# EAGLE design SkyLab V5 (EAGLE 9.0.1)
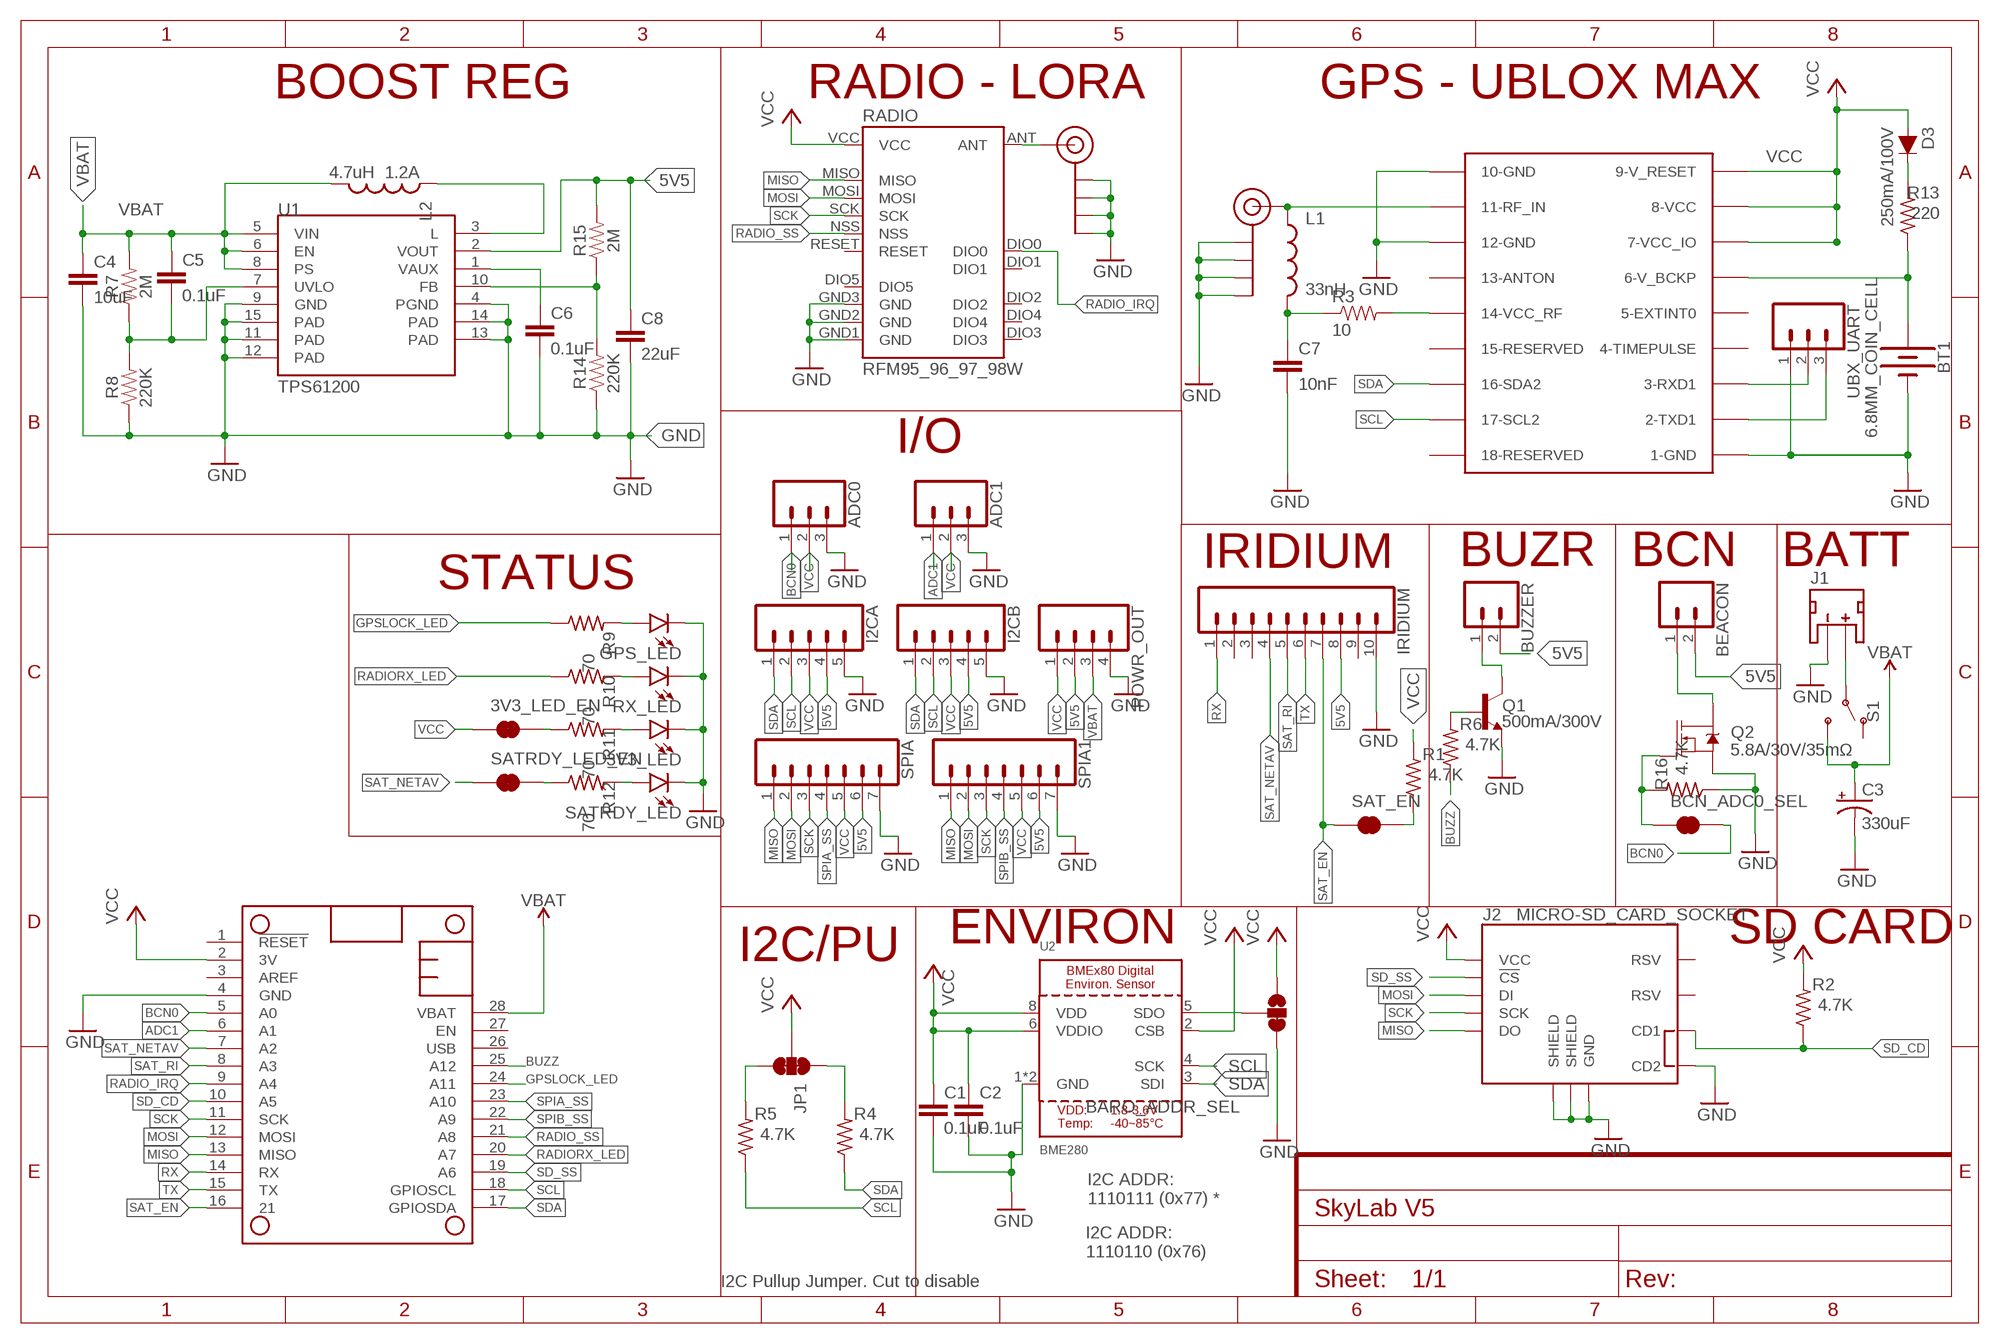
[diagram p0: schematic, sheet 1]
FRAME1 (FRAME-A4L): CNAME: HLM StemLab @ ASFM; CREVISION: 1.0

## Parts
3V3_LED  LED1206  [LED-1206]
3V3_LED_EN  JUMPER-SMT_2_NC_TRACE_SILK  [SMT-JUMPER_2_NC_TRACE_SILK]
ADC0  CONN_03  [1X03]
ADC1  CONN_03  [1X03]
BARO_ADDR_SEL  JUMPER-SMT_3_1-NC_TRACE_SILK  [SMT-JUMPER_3_1-NC_TRACE_SILK]
BCN_ADC0_SEL  JUMPER-SMT_2_NC_TRACE_SILK  [SMT-JUMPER_2_NC_TRACE_SILK]
BEACON  CONN_02  [1X02]
BT1  6.8MM_COIN_CELL  BATTERY-6.8MM_SMD  [BATTCON-6.8MM]
BUZZER  CONN_02  [1X02]
C1  0.1uF  0.1UF-0603-25V-(+80/-20%)  [0603]
C2  0.1uF  0.1UF-0603-25V-(+80/-20%)  [0603]
C3  330uF  CAP_POL6032  [EIA6032]
C4  10uF  10UF-1206-6.3V-20%  [1206]
C5  0.1uF  0.1UF-0603-25V-(+80/-20%)  [0603]
C6  0.1uF  0.1UF-0603-25V-(+80/-20%)  [0603]
C7  10nF  0.1UF-0603-25V-(+80/-20%)  [0603]
C8  22uF  22UF-0805-6.3V-20%  [0805]
D3  250mA/100V  DIODE-BAS16J  [SOD-323]
GPS_ANT  SMA_EDGE  [SMA-EDGE]
GPS_LED  LED1206  [LED-1206]
I2CA  CONN_05  [1X05]
I2CB  CONN_05  [1X05]
IRIDIUM  CONN_10"  [1X10]
J1  JST_2MM_MALE  [JST-2-SMD]
J2  MICRO-SD_CARD_SOCKET  [MICRO-SD-SOCKET]
JP1  JUMPER-SMT_3_2-NC_TRACE_SILK  [SMT-JUMPER_3_2-NC_TRACE_SILK]
L1  33nH  INDUCTOR0603  [0603]
L2  4.7uH 1.2A  INDUCTOR0603  [0603]
MS1  FEATHERWING_NODIM  [FEATHERWING_DIM]
POWR_OUT  CONN_04  [1X04]
Q1  500mA/300V  TRANS_NPN-MMBTA42  [SOT23-3]
Q2  5.8A/30V/35mΩ  MOSFET-NCH-AO3404A  [SOT23-3]
R1  4.7K  R-US_M0805  [M0805]
R2  4.7K  R-US_M0805  [M0805]
R3  10  RESISTOR0603-RES  [0603-RES]
R4  4.7K  R-US_M0805  [M0805]
R5  4.7K  R-US_M0805  [M0805]
R6  4.7K  R-US_M0805  [M0805]
R7  2M  0.22OHM-0805-1/4W-1%  [0805]
R8  220K  0.22OHM-0805-1/4W-1%  [0805]
R9  70  R-US_M0805  [M0805]
R10  70  R-US_M0805  [M0805]
R11  70  R-US_M0805  [M0805]
R12  70  R-US_M0805  [M0805]
R13  220  R-US_M0805  [M0805]
R14  220K  0.22OHM-0805-1/4W-1%  [0805]
R15  2M  0.22OHM-0805-1/4W-1%  [0805]
R16  4.7K  R-US_M0805  [M0805]
RADIO  RFM95_96_97_98W  [RFM95_96_97_98W]
RDIO_ANT  SMA_EDGE  [SMA-EDGE]
RX_LED  LED1206  [LED-1206]
S1  SWITCH-SPDT-SMD-RIGHT-ANGLE  [SWITCH_SPST_SMD_A]
SAT_EN  JUMPER-SMT_2_NC_TRACE_SILK  [SMT-JUMPER_2_NC_TRACE_SILK]
SATRDY_LED  LED1206  [LED-1206]
SATRDY_LED_EN  JUMPER-SMT_2_NC_TRACE_SILK  [SMT-JUMPER_2_NC_TRACE_SILK]
SPIA  CONN_07  [1X07]
SPIA1  CONN_07  [1X07]
U1  TPS61200  [QFN-10_PAD]
U2  BME280  [BME280]
UBLOX  UBLOX_MAX  [UBLOX_MAX]
UBX_UART  CONN_03  [1X03]

## Nets
5V5: BEACON.2 BUZZER.2 C8.1 I2CA.4 I2CB.4 IRIDIUM.8 POWR_OUT.2 R15.2 SPIA1.6 SPIA.6 U1.2(VOUT)
ADC1: ADC1.1 MS1.6(A1)
BCN0: ADC0.1 BCN_ADC0_SEL.2 MS1.5(A0)
BUZZ: MS1.25(A12) R6.1
EDITINF: BCN_ADC0_SEL.1 Q2.1(G) R16.2
GND: 3V3_LED.C ADC0.3 ADC1.3 BARO_ADDR_SEL.3 BT1.- C1.2 C2.2 C3.P$2(-) C4.2 C6.2 C7.2 C8.2 GPS_ANT.GND@0(GND) GPS_ANT.GND@1(GND) GPS_ANT.GND@2(GND) GPS_ANT.GND@3(GND) GPS_LED.C I2CA.5 I2CB.5 IRIDIUM.10 J1.1(-) J2.CD2 J2.GND J2.GND1(SHIELD) J2.GND3(SHIELD) MS1.4(GND) POWR_OUT.4 Q1.2(E) Q2.2(S) R8.1 R14.1 R16.1 RADIO.GND1(GND) RADIO.GND2(GND) RADIO.GND3(GND) RDIO_ANT.GND@0(GND) RDIO_ANT.GND@1(GND) RDIO_ANT.GND@2(GND) RDIO_ANT.GND@3(GND) RX_LED.C SATRDY_LED.C SPIA1.7 SPIA.7 U1.4(PGND) U1.9(GND) U1.11(PAD) U1.12(PAD) U1.13(PAD) U1.14(PAD) U1.15(PAD) U2.1(GND) U2.7(GND) UBLOX.1-GND UBLOX.10-GND UBLOX.12-GND UBX_UART.1
GPSLOCK_LED: MS1.24(A11) R9.1
MISO: J2.DO MS1.13(MISO) RADIO.MISO SPIA1.1 SPIA.1
MOSI: J2.DI MS1.12(MOSI) RADIO.MOSI SPIA1.2 SPIA.2
N$1: R1.1 SAT_EN.2
N$2: GPS_ANT.SIG(SIGNAL) L1.1 UBLOX.11-RFIN(11-RF_IN)
N$3: C7.1 L1.2 R3.1
N$4: R3.2 UBLOX.14-VCC_RF
N$5: RADIO.ANT RDIO_ANT.SIG(SIGNAL)
N$6: JP1.3 R5.2
N$7: JP1.1 R4.2
N$8: Q1.1(B) R6.2
N$9: BUZZER.1 Q1.3(C)
N$10: GPS_LED.A R9.2
N$11: BT1.+ R13.1 UBLOX.6-V_BCKP
N$12: R12.1 SATRDY_LED_EN.2
N$13: R10.2 RX_LED.A
N$14: 3V3_LED.A R11.2
N$15: 3V3_LED_EN.2 R11.1
N$16: D3.C R13.2
N$17: BARO_ADDR_SEL.2 U2.5(SDO)
N$18: R12.2 SATRDY_LED.A
N$19: C5.2 R7.1 R8.2 U1.7(UVLO)
N$20: UBLOX.3-RXD1 UBX_UART.2
N$21: UBLOX.2-TXD1 UBX_UART.3
N$22: R14.2 R15.1 U1.10(FB)
N$23: L2.1 U1.3(L)
N$24: C6.1 U1.1(VAUX)
N$25: BEACON.1 Q2.3(D)
RADIO_IRQ: MS1.9(A4) RADIO.DIO0
RADIO_SS: MS1.21(A8) RADIO.NSS
RADIORX_LED: MS1.20(A7) R10.1
RX: IRIDIUM.1 MS1.14(RX)
SAT_EN: IRIDIUM.7 MS1.16 SAT_EN.1
SAT_NETAV: IRIDIUM.4 MS1.7(A2) SATRDY_LED_EN.1
SAT_RI: IRIDIUM.5 MS1.8(A3)
SCK: J2.SCLK(SCK) MS1.11(SCK) RADIO.SCK SPIA1.3 SPIA.3
SCL: I2CA.2 I2CB.2 MS1.18(GPIOSCL) R5.1 U2.4(SCK) UBLOX.17-SCL2
SD_CD: J2.CD1 MS1.10(A5) R2.1
SD_SS: J2.CS(!CS) MS1.19(A6)
SDA: I2CA.1 I2CB.1 MS1.17(GPIOSDA) R4.1 U2.3(SDI) UBLOX.16-SDA2
SPIA_SS: MS1.23(A10) SPIA.4
SPIB_SS: MS1.22(A9) SPIA1.4
TX: IRIDIUM.6 MS1.15(TX)
VBAT: C3.P$1(+) C4.1 C5.1 L2.2 MS1.28(VBAT) POWR_OUT.3 R7.2 S1.3(S) U1.5(VIN) U1.6(EN) U1.8(PS)
VBAT_SUPPLY: J1.2(+) S1.2(P)
VCC: 3V3_LED_EN.1 ADC0.2 ADC1.2 BARO_ADDR_SEL.1 C1.1 C2.1 D3.A I2CA.3 I2CB.3 J2.VCC JP1.2 MS1.2(3V) POWR_OUT.1 R1.2 R2.2 RADIO.VCC SPIA1.5 SPIA.5 U2.2(CSB) U2.6(VDDIO) U2.8(VDD) UBLOX.7-VCC_IO UBLOX.8-VCC UBLOX.9-V_RESET
Unconnected: IRIDIUM.2 IRIDIUM.3 IRIDIUM.9 J1.NC1(PAD1) J1.NC2(PAD2) J2.RSV1(RSV) J2.RSV2(RSV) MS1.1(!RESET) MS1.3(AREF) MS1.26(USB) MS1.27(EN) RADIO.DIO1 RADIO.DIO2 RADIO.DIO3 RADIO.DIO4 RADIO.DIO5 RADIO.RESET S1.1(O) UBLOX.4-TIMEPULSE UBLOX.5-EXTINT0 UBLOX.13-ANTON UBLOX.15-RESERVED UBLOX.18-RESERVED

## Notes on the sheet
- BOOST REG | RADIO - LORA | GPS - UBLOX MAX
- I/O
- IRIDIUM | BUZR | BCN | BATT
- STATUS
- ENVIRON | SD CARD
- I2C/PU
- I2C ADDR:
  1110111 (0x77) *
- I2C ADDR:
  1110110 (0x76)
- I2C Pullup Jumper. Cut to disable

## Library data of the parts
3V3_LED GPS_LED RX_LED SATRDY_LED = SparkFun-LED:LED: LED (Generic) Standard schematic elements and footprints for 5mm, 3mm, 1206, and 0603 sized LEDs. Generic LEDs with no color specified.
3V3_LED_EN BCN_ADC0_SEL SAT_EN SATRDY_LED_EN = SparkFun-Jumpers:JUMPER-SMT_2_NC_TRACE: Normally closed trace jumper This jumper has a trace between two pads so it's normally closed (NC). Use a razor knife to open the connection. For best results follow the IPC guidelines for cutting traces: Cutout at least 0.063 mm (0.005 in). Remove all loose material to clean up the cut area. Seal the cut with an approved epoxy. Reapply solder to reclose the connection.
ADC0 ADC1 UBX_UART = SparkFun-Connectors:CONN_03: Multi connection point. Often used as Generic Header-pin footprint for 0.1 inch spaced/style header connections On any of the 0.1 inch spaced packages, you can populate with these: Break Away Headers - Straight (PRT-00116) Break Away Male Headers - Right Angle (PRT-00553) Female Headers (PRT-00115) Break Away Headers - Machine Pin (PRT-00117) Break Away Female Headers - Swiss Machine Pin (PRT-00743) Stackable Header - 3 Pin (Female, 0.1") (PRT-13875) For SCREWTERMINALS and SPRING TERMINALS visit here: Screw Terimnals on SparkFun.com (5mm/3.5mm/2.54mm spacing) This device is also useful as a general connection point to wire up your design to another part of your project. Our various solder wires solder well into these plated through hole pads. Hook-Up Wire - Assortment (Stranded, 22 AWG) (PRT-11375) Hook-Up Wire - Assortment (Solid Core, 22 AWG) (PRT-11367) View the entire wire category on our website here Special notes: Molex polarized connector foot print use with SKU : PRT-08232 with associated crimp pins and housings.
BARO_ADDR_SEL = SparkFun-Jumpers:JUMPER-SMT_3_1-NC_TRACE: Normally closed trace jumper (1 of 2 connections) This jumper has a trace between two pads so it's normally closed (NC). The other connection is normally open (NO). Use a razor knife to open the connection. For best results follow the IPC guidelines for cutting traces: Cutout at least 0.063 mm (0.005 in). Remove all loose material to clean up the cut area. Seal the cut with an approved epoxy. Reapply solder to reclose the connection, or to close the NO connection.
BEACON BUZZER = SparkFun-Connectors:CONN_02: Multi connection point. Often used as Generic Header-pin footprint for 0.1 inch spaced/style header connections On any of the 0.1 inch spaced packages, you can populate with these: Break Away Headers - Straight (PRT-00116) Break Away Male Headers - Right Angle (PRT-00553) Female Headers (PRT-00115) Break Away Headers - Machine Pin (PRT-00117) Break Away Female Headers - Swiss Machine Pin (PRT-00743) For SCREWTERMINALS and SPRING TERMINALS visit here: Screw Terimnals on SparkFun.com (5mm/3.5mm/2.54mm spacing) This device is also useful as a general connection point to wire up your design to another part of your project. Our various solder wires solder well into these plated through hole pads. Hook-Up Wire - Assortment (Stranded, 22 AWG) (PRT-11375) Hook-Up Wire - Assortment (Solid Core, 22 AWG) (PRT-11367) View the entire wire category on our website here Special notes: Molex polarized connector foot print use with: PRT-08233 with associated crimp pins and housings. 2.54_SCREWTERM for use with PRT-10571. 3.5mm Screw Terminal footprints for PRT-08084 5mm Screw Terminal footprints for use with PRT-08432
BT1 = SparkFun-Batteries:BATTERY: Battery - Single Cell A variety of battery chemistries, sizes, and footprints. Device List: 20MM_PTH - Coin Cell Battery Holder - 20mm (PTH) 6.8MM_PTH - Coin Cell Battery Holder - 6.8MM(SMD) 12MM_SMD - Coin Cell Battery Holder - 12mm (SMD) 12MM_PTH - Coin Cell Battery Holder - 12mm (PTH) 20MM_SMD - 20mm Coin Cell Battery Holder (SMD) (2 legs) Used on the Big Time Watch Kit 20MM_SMD_4LEGS - Coin Cell Battery Holder - 20mm (SMD) 20MM_SMD_4LEGS_OVERPASTE - Coin Cell Battery Holder - 20mm (SMD) (Over-paste on the legs) 24.5MM_PTH - Coin Cell Battery Holder - 24.5mm (PTH) 9V - 9V Battery Holder - PC Mount Used on the SparkFun SparkPunk Sound Kit and SparkFun SparkPunk Sequencer Kit 18650 - Battery Holder - 18650 (PTH) AA - Battery Holder - 1xAA (PTH) AAA - Battery Holder - 1xAAA (PTH) AA_KIT - Battery Holder - 1xAA (PTH) Special kit package - pads only have exposed copper on one side of the board. AAA_KIT - Battery Holder - 1xAAA (PTH) Special kit package - pads only have exposed copper on one side of the board.; PROD_ID: BATT-13734
C1 C2 C5 C6 = SparkFun-Capacitors:0.1UF: 0.1µF ceramic capacitors A capacitor is a passive two-terminal electrical component used to store electrical energy temporarily in an electric field.; PROD_ID: CAP-00810
C3 = SparkFun-Passives:CAP_POL: Capacitor Polarized These are standard SMD and PTH capacitors. Normally 10uF, 47uF, and 100uF in electrolytic and tantalum varieties. Always verify the external diameter of the through hole cap, it varies with capacity, voltage, and manufacturer. The EIA devices should be standard.
C4 = SparkFun-Capacitors:10UF: 10.0µF ceramic capacitors A capacitor is a passive two-terminal electrical component used to store electrical energy temporarily in an electric field.; PROD_ID: CAP-10057
C7 = SparkFun-Capacitors:0.1UF: 0.1µF ceramic capacitors A capacitor is a passive two-terminal electrical component used to store electrical energy temporarily in an electric field.; PROD_ID: CAP-00810; VALUE: 0.1uF
C8 = SparkFun-Capacitors:22UF: 22µF ceramic capacitors A capacitor is a passive two-terminal electrical component used to store electrical energy temporarily in an electric field.; PROD_ID: CAP-08402
D3 = SparkFun-DiscreteSemi:DIODE: Diode These are standard reverse protection diodes and small signal diodes. SparkFun Products: SparkFun SparkPunk Sound Kit <https://www.sparkfun.com/products/11177> SparkFun ESP8266 Thing <https://www.sparkfun.com/products/13231>; PROD_ID: DIO-09646
GPS_ANT = SparkFun:SMA_EDGE: SMA Antenna Connector End launch SMA connector. The paste layer has been removed so that the connector can be hand soldered onto the board after reflow.
I2CA I2CB = SparkFun-Connectors:CONN_05: Multi connection point. Often used as Generic Header-pin footprint for 0.1 inch spaced/style header connections On any of the 0.1 inch spaced packages, you can populate with these: Break Away Headers - Straight (PRT-00116) Break Away Male Headers - Right Angle (PRT-00553) Female Headers (PRT-00115) Break Away Headers - Machine Pin (PRT-00117) Break Away Female Headers - Swiss Machine Pin (PRT-00743) For SCREWTERMINALS and SPRING TERMINALS visit here: Screw Terimnals on SparkFun.com (5mm/3.5mm/2.54mm spacing) This device is also useful as a general connection point to wire up your design to another part of your project. Our various solder wires solder well into these plated through hole pads. Hook-Up Wire - Assortment (Stranded, 22 AWG) (PRT-11375) Hook-Up Wire - Assortment (Solid Core, 22 AWG) (PRT-11367) View the entire wire category on our website here Special notes: Molex polarized connector foot print use with SKU : PRT-08231 with associated crimp pins and housings. 1MM SMD Version SKU: PRT-10208
IRIDIUM = SparkFun-Connectors:CONN_10: Multi connection point. Often used as Generic Header-pin footprint for 0.1 inch spaced/style header connections On any of the 0.1 inch spaced packages, you can populate with these: Break Away Headers - Straight (PRT-00116) Break Away Male Headers - Right Angle (PRT-00553) Female Headers (PRT-00115) Break Away Headers - Machine Pin (PRT-00117) Break Away Female Headers - Swiss Machine Pin (PRT-00743) Arduino Stackable Header - 10 Pin (PRT-11376) For SCREWTERMINALS and SPRING TERMINALS visit here: Screw Terimnals on SparkFun.com (5mm/3.5mm/2.54mm spacing) This device is also useful as a general connection point to wire up your design to another part of your project. Our various solder wires solder well into these plated through hole pads. Hook-Up Wire - Assortment (Stranded, 22 AWG) (PRT-11375) Hook-Up Wire - Assortment (Solid Core, 22 AWG) (PRT-11367) View the entire wire category on our website here Special notes: Molex polarized connector foot print use with SKU : PRT-08231 with associated crimp pins and housings. 1MM SMD Version SKU: PRT-10208 NOTES ON THE VARIANTS LOCK and LOCK_LONGPADS... This footprint was designed to help hold the alignment of a through-hole component (i.e. 6-pin header) while soldering it into place. You may notice that each hole has been shifted either up or down by 0.005 of an inch from it's more standard position (which is a perfectly straight line). This slight alteration caused the pins (the squares in the middle) to touch the edges of the holes. Because they are alternating, it causes a "brace" to hold the component in place. 0.005 has proven to be the perfect amount of "off-center" position when using our standard breakaway headers. Although looks a little odd when you look at the bare footprint, once you have a header in there, the alteration is very hard to notice. Also,if you push a header all the way into place, it is covered up entirely on the bottom side.; PROD_ID: CONN-11563
J1 = SparkFun-Connectors:JST_2MM_MALE: JST 2MM MALE RA CONNECTOR Two pin, compact surface mount connector. Commonly used as a battery input connection point. We really like the solid locking feeling and high current rating on these small connectors. We use these all the time as battery connectors. Mates to single-cell LiPo batteries. Here is the connector we sell at SparkFun: JST Right Angle Connector - White (PRT-08612) Datasheet It was used on these SparkFun products: SparkFun MOSFET Power Controller (PRT-11214) SparkFun Battery Babysitter - LiPo Battery Manager (PRT-13777) And many, many others that required a lipo battery connection.; PROD_ID: CONN-11443; SF_ID: PRT-08612
J2 = SparkFun-Connectors:MICRO-SD_CARD_SOCKET: microSD Socket for Transflash Push-push type µSD socket. tDoc lines correctly indicate media card edge positions when inserting (unlocked, locked, depressed). NOTE: CD1 and CD2 are connected internally, and the default detect state of the socket is detect pin to ground. SparkFun Products: WAV Trigger <https://www.sparkfun.com/products/13660> CAN-Bus Shield <https://www.sparkfun.com/products/13262> SparkFun Level Shifing microSD Breakout <https://www.sparkfun.com/products/13743>; PROD_ID: CONN-07820; SF_ID: PRT-00127
JP1 = SparkFun-Jumpers:JUMPER-SMT_3_2-NC_TRACE: Normally closed trace jumper (2 of 2 connections) This jumper has a trace between all three pads so they are normally closed (NC). Use a razor knife to open the connection(s). For best results follow the IPC guidelines for cutting traces: Cutout at least 0.063 mm (0.005 in). Remove all loose material to clean up the cut area. Seal the cut with an approved epoxy. Reapply solder to reclose the connection(s).
L1 L2 = SparkFun:INDUCTOR: Inductors Basic Inductor/Choke - 0603 and 1206. Footprints are not proven and vary greatly between part numbers.
MS1 = adafruit:FEATHERWING
POWR_OUT = SparkFun-Connectors:CONN_04: Multi connection point. Often used as Generic Header-pin footprint for 0.1 inch spaced/style header connections On any of the 0.1 inch spaced packages, you can populate with these: Break Away Headers - Straight (PRT-00116) Break Away Male Headers - Right Angle (PRT-00553) Female Headers (PRT-00115) Break Away Headers - Machine Pin (PRT-00117) Break Away Female Headers - Swiss Machine Pin (PRT-00743) For SCREWTERMINALS and SPRING TERMINALS visit here: Screw Terimnals on SparkFun.com (5mm/3.5mm/2.54mm spacing) This device is also useful as a general connection point to wire up your design to another part of your project. Our various solder wires solder well into these plated through hole pads. Hook-Up Wire - Assortment (Stranded, 22 AWG) (PRT-11375) Hook-Up Wire - Assortment (Solid Core, 22 AWG) (PRT-11367) View the entire wire category on our website here Special notes: Molex polarized connector foot print use with SKU : PRT-08231 with associated crimp pins and housings. 1MM SMD Version SKU: PRT-10208; PROD_ID: CONN-09696
Q1 = SparkFun-DiscreteSemi:TRANS_NPN: NPN transistor Current controlled devices typically used to amplify current or used as a switch. BC547 - COM-08928 (TO-92 45V 100mA) (1.Collector 2.Base 3.Emitter) 2N3904 - COM-00521 (TO-92 40V 200mA) (1.Emitter 2.Base 3.Collector) P2N2222A - COM-12852 (TO-92 40V 600mA) (1.Collector 2.Base 3.Emitter); PROD_ID: TRANS-09116
Q2 = SparkFun-DiscreteSemi:MOSFET-NCH: N-channel MOSFETs Voltage controlled devices that allow control of high current outputs. SparkFun Products: SparkFun OpenScale <https://www.sparkfun.com/products/13261> SparkFun Digital Sandbox <https://www.sparkfun.com/products/12651> SparkFun Monster Moto Shield <https://www.sparkfun.com/products/10182> SparkFun MOSFET Power Controller <https://www.sparkfun.com/products/11214>; PROD_ID: TRANS-12988
R1 R2 R4-R6 R9-R13 R16 = resistor:R-US_: RESISTOR, American symbol
R3 = SparkFun:RESISTOR: Resistor Basic schematic elements and footprints for 0603, 1206, and PTH resistors.
R7 R8 R14 R15 = SparkFun-Resistors:0.22OHM: 0.22Ω resistor A resistor is a passive two-terminal electrical component that implements electrical resistance as a circuit element. Resistors act to reduce current flow, and, at the same time, act to lower voltage levels within circuits. - Wikipedia; PROD_ID: RES-09883; VALUE: 0.22
RADIO = Ava:RFM95_96_97_98W
RDIO_ANT = SparkFun-Retired:SMA_EDGE: SMA Antenna Connector End launch SMA connector. The paste layer has been removed so that the connector can be hand soldered onto the board after reflow.
S1 = SparkFun-Switches:SWITCH-SPDT: Single Pole, Double Throw (SPDT) Switch Single-pole, double-throw (SPDT) switch. Variant Overview SMD-AYZ0202 Surface Mount DPDT Switch (COM-00597) Used on e.g. LilyPad Arduino USB - ATmega32U4 Board PTH-11.6X4.0MM SPDT Mini Power Switch (COM-00102) Used on e.g. SparkFun Simon Says - Through-Hole Soldering Kit (KIT-10547) PTH-11.6X4.0MM-KIT KIT version of SPDT Mini Power Switch - Simplifies soldering by removing tStop of switch pins - only one side can be soldered. PTH-11.6X4.0MM-LOCK LOCK version of SPDT Mini Power Switch - Offset pins hold switch in place for easier soldering. SMD-RIGHT-ANGLE Surface Mount Right Angle Switch (COM-10860) Used on e.g. SparkFun ESP8266 Thing; PROD_ID: SWCH-10651; SF_SKU: COM-10860
SPIA SPIA1 = SparkFun-Connectors:CONN_07: Multi connection point. Often used as Generic Header-pin footprint for 0.1 inch spaced/style header connections On any of the 0.1 inch spaced packages, you can populate with these: Break Away Headers - Straight (PRT-00116) Break Away Male Headers - Right Angle (PRT-00553) Female Headers (PRT-00115) Break Away Headers - Machine Pin (PRT-00117) Break Away Female Headers - Swiss Machine Pin (PRT-00743) For SCREWTERMINALS and SPRING TERMINALS visit here: Screw Terimnals on SparkFun.com (5mm/3.5mm/2.54mm spacing) This device is also useful as a general connection point to wire up your design to another part of your project. Our various solder wires solder well into these plated through hole pads. Hook-Up Wire - Assortment (Stranded, 22 AWG) (PRT-11375) Hook-Up Wire - Assortment (Solid Core, 22 AWG) (PRT-11367) View the entire wire category on our website here Special notes: Molex polarized connector foot print use with SKU : PRT-08231 with associated crimp pins and housings. 1MM SMD Version SKU: PRT-10208 NOTES ON THE VARIANTS LOCK and LOCK_LONGPADS... This footprint was designed to help hold the alignment of a through-hole component (i.e. 6-pin header) while soldering it into place. You may notice that each hole has been shifted either up or down by 0.005 of an inch from it's more standard position (which is a perfectly straight line). This slight alteration caused the pins (the squares in the middle) to touch the edges of the holes. Because they are alternating, it causes a "brace" to hold the component in place. 0.005 has proven to be the perfect amount of "off-center" position when using our standard breakaway headers. Although looks a little odd when you look at the bare footprint, once you have a header in there, the alteration is very hard to notice. Also,if you push a header all the way into place, it is covered up entirely on the bottom side.
U1 = SparkFun-IC-Power:TPS61200: DC to DC Booster IC-10035; PROD_ID: IC-10035
U2 = microbuilder:BME280: BME280 - Environmental Sensor (I2C + SPI)
UBLOX = Ava:UBLOX_MAX: UBLOX MAX

## Module E
Ports: 

### Library data of the parts

## Net classes
0 default: width 0.203 mm
1 vcc: width 0.254 mm

## Board
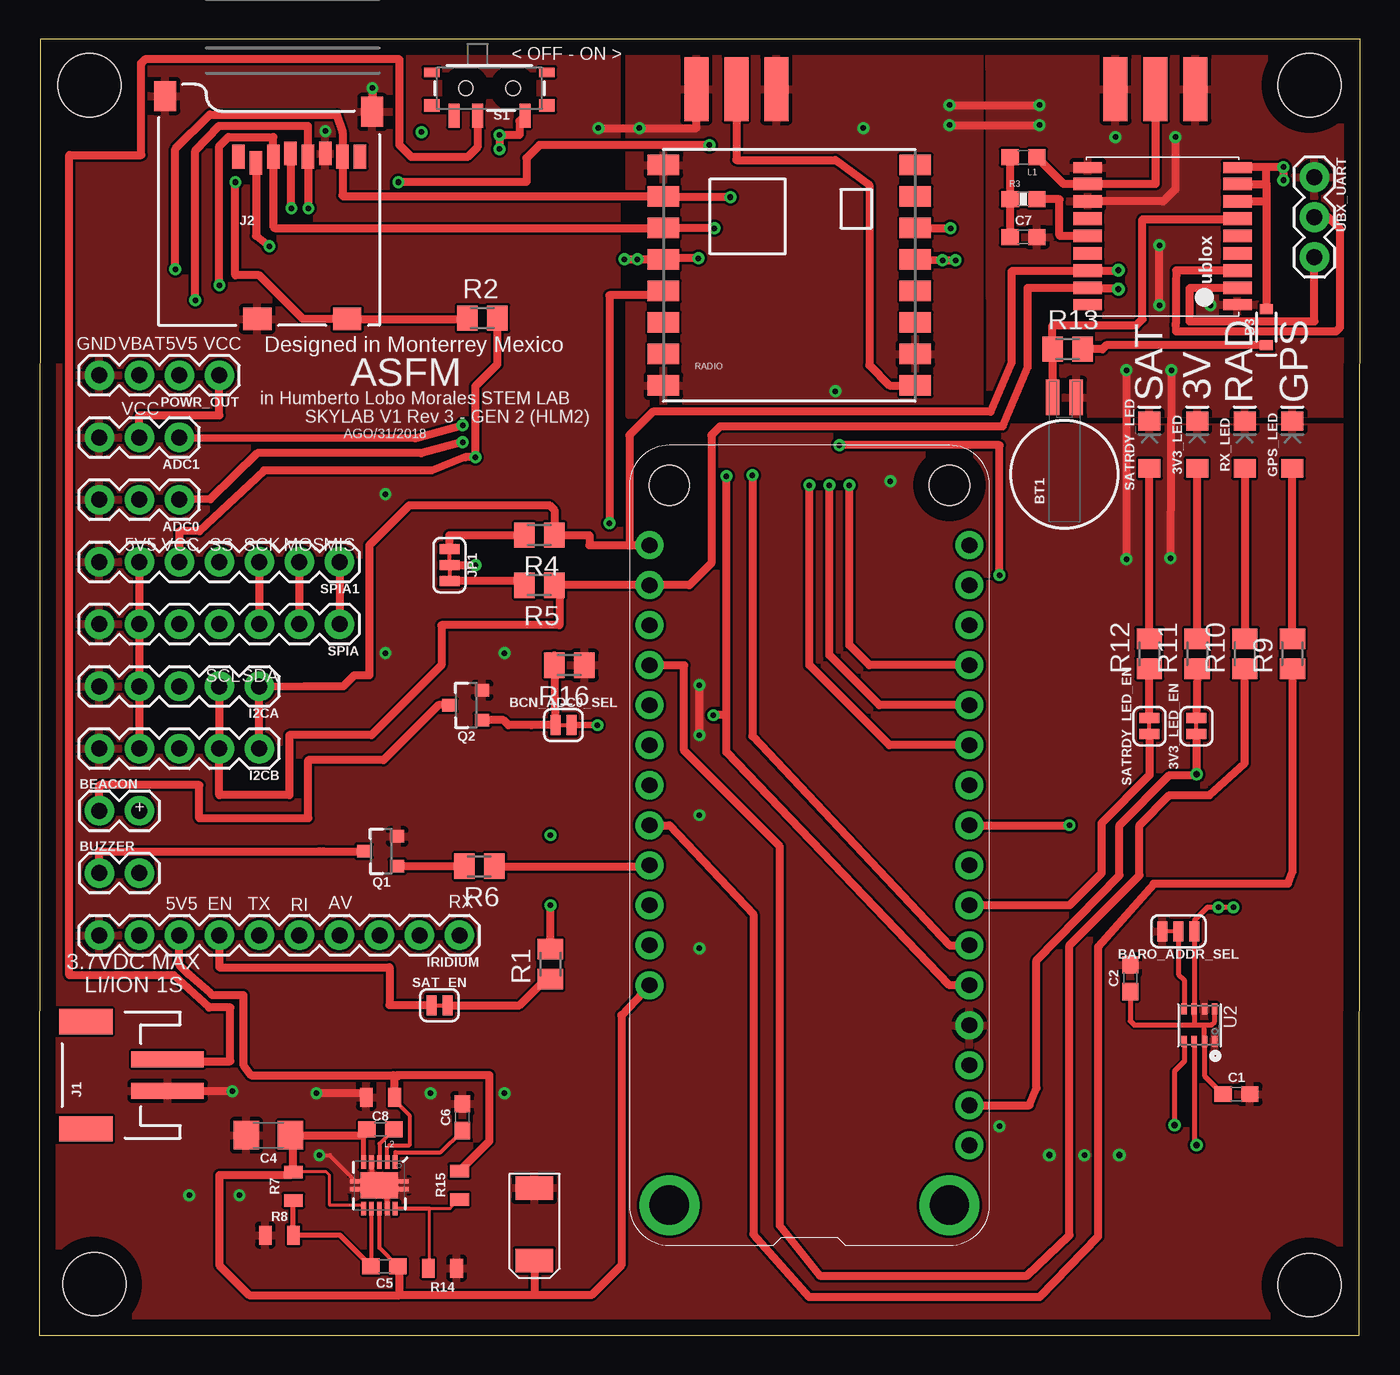
[diagram p1: board, top side]
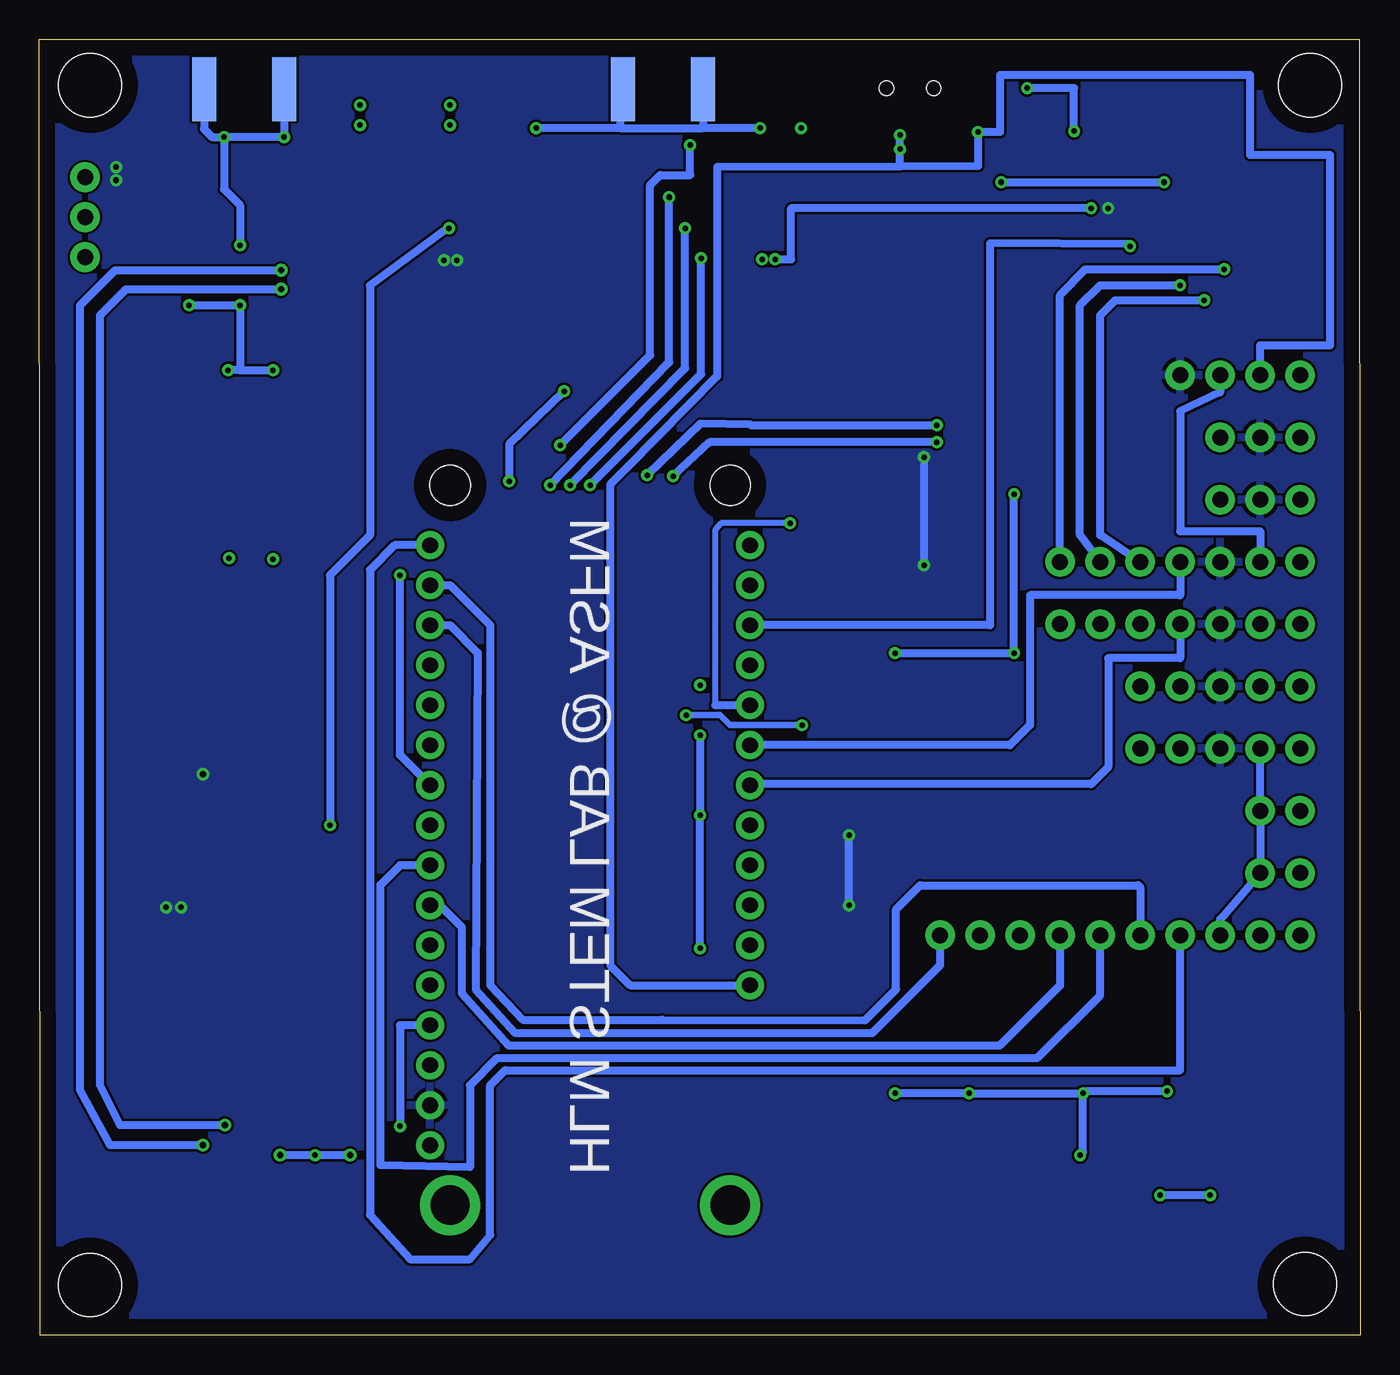
[diagram p2: board, bottom side, seen from below]

Size 83.86 x 82.28 mm. Coordinates in mm from the lower left corner, seen from the top.
Outline: 0,0 83.8,0 83.86,82.28 0.06,82.28 0,0
Copper layers (1*16): Top 0.035mm / dielectric 1.5mm / Bottom 0.035mm
Design rules "default": minimum track width 6mil, minimum drill 0.35mm, track to track 6mil, track to pad 6mil, pad to pad 6mil, via to via 6mil, smd to smd 6mil, copper to edge 40mil, drill to drill 6mil, minimum pad ring 10mil, minimum via ring 8mil, stop-mask expansion 4mil, vias tented up to drill 0mil, thermal gap 10mil
Holes 4 mm at 3.17,79.38 3.49,3.24 80.64,79.38 80.64,3.18

### Footprints (pad centres in the part's own frame; a part is rotated, then mirrored left to right if it is on the bottom)
LED-1206 = smd 1.2 x 1.4: A -1.5,0; C 1.5,0
SMT-JUMPER_2_NC_TRACE_SILK = smd 0.635 x 1.27: 1 -0.508,0; 2 0.508,0
1X03 = drill 1.016 pad 1.88: 1 0,0; 2 2.54,0; 3 5.08,0
SMT-JUMPER_3_1-NC_TRACE_SILK = smd 0.635 x 1.27: 1 -1.016,0; 2 0,0; 3 1.016,0
1X02 = drill 1.016 pad 1.88: 1 0,0; 2 2.54,0
BATTCON-6.8MM = smd 2.25 x 0.85: + 4.87,0.75; - 4.87,-0.75
0603 = smd 1.1 x 1: 1 -0.85,0; 2 0.85,0
EIA6032 = smd 1.5 x 2.4: P$1 -2.3,0; P$2 2.3,0
1206 = smd 1.6 x 1.8: 1 -1.4,0; 2 1.4,0
0805 = smd 0.8 x 1.2: 1 -0.9,0; 2 0.9,0
SOD-323 = smd 0.63 x 0.83: A 1.15,0; C -1.15,0
SMA-EDGE = smd 1.524 x 4.064: GND@0 -2.54,0; GND@1 2.54,0; SIG 0,0 | smd 1.524 x 4.064 bottom: GND@2 -2.54,0; GND@3 2.54,0
1X05 = drill 1.016 pad 1.88: 1 0,0; 2 2.54,0; 3 5.08,0; 4 7.62,0; 5 10.16,0
1X10 = drill 1.016 pad 1.88: 1 0,0; 2 2.54,0; 3 5.08,0; 4 7.62,0; 5 10.16,0; 6 12.7,0; 7 15.24,0; 8 17.78,0; 9 20.32,0; 10 22.86,0
JST-2-SMD = smd 1 x 4.6: 1 -1,-3.7; 2 1,-3.7 | smd 1.6 x 3.4: NC1 -3.4,1.5; NC2 3.4,1.5
MICRO-SD-SOCKET = smd 1.8 x 1.4: CD1 -2.05,0.4; CD2 -7.75,0.4 | smd 0.8 x 1.5: CS -7.84,10.3; DI -6.74,10.7; DO -2.34,10.7; GND -3.44,10.9; RSV1 -8.94,10.7; RSV2 -1.24,10.7; SCLK -4.54,10.7; VCC -5.64,10.9 | smd 1.4 x 1.9: GND1 -13.6,14.55; GND3 -0.45,13.55
SMT-JUMPER_3_2-NC_TRACE_SILK = smd 0.635 x 1.27: 1 -1.016,0; 2 0,0; 3 1.016,0
FEATHERWING_DIM = drill 1 pad 1.778: 1 6.35,1.27; 2 8.89,1.27; 3 11.43,1.27; 4 13.97,1.27; 5 16.51,1.27; 6 19.05,1.27; 7 21.59,1.27; 8 24.13,1.27; 9 26.67,1.27; 10 29.21,1.27; 11 31.75,1.27; 12 34.29,1.27; 13 36.83,1.27; 14 39.37,1.27; 15 41.91,1.27; 16 44.45,1.27; 17 44.45,21.59; 18 41.91,21.59; 19 39.37,21.59; 20 36.83,21.59; 21 34.29,21.59; 22 31.75,21.59; 23 29.21,21.59; 24 26.67,21.59; 25 24.13,21.59; 26 21.59,21.59; 27 19.05,21.59; 28 16.51,21.59 | drill 2.5 pad 3.81: P$1 2.54,20.32; P$2 2.54,2.54 | hole 2.54: 48.26,20.32; 48.26,2.54
1X04 = drill 1.016 pad 1.88: 1 0,0; 2 2.54,0; 3 5.08,0; 4 7.62,0
SOT23-3 = smd 0.8 x 0.9: 1 -0.95,-1; 2 0.95,-1; 3 0,1.1
M0805 = smd 1.3 x 1.6: 1 -0.95,0; 2 0.95,0
0603-RES = smd 1.1 x 1: 1 -0.85,0; 2 0.85,0
RFM95_96_97_98W = smd 2 x 1.3: ANT 8,-7; DIO0 8,3; DIO1 8,5; DIO2 8,7; DIO3 8,-3; DIO4 8,-1; DIO5 -8,-5; GND1 -8,7; GND2 8,-5; GND3 -8,-7; MISO -8,5; MOSI -8,3; NSS -8,-1; RESET -8,-3; SCK -8,1; VCC 8,1
SMA-EDGE' = smd 1.524 x 4.064: GND@0 0,0; GND@1 5.08,0; SIG 2.54,0 | smd 1.524 x 4.064 bottom: GND@2 0,0; GND@3 5.08,0
SWITCH_SPST_SMD_A = smd 0.7 x 1.5: 1 -2.25,-1.75; 2 -0.75,-1.75; 3 2.25,-1.75 | smd 1 x 0.6: GND1 -3.65,1; GND3 3.65,1 | smd 1 x 0.8: GND2 -3.65,-1.1; GND4 3.65,-1.1 | hole 0.9: -1.5,0; 1.5,0
1X07 = drill 1.016 pad 1.88: 1 0,0; 2 2.54,0; 3 5.08,0; 4 7.62,0; 5 10.16,0; 6 12.7,0; 7 15.24,0
QFN-10_PAD = smd 0.297 x 0.85: 1 -1,-1.475; 2 -0.5,-1.475; 3 0,-1.475; 4 0.5,-1.475; 5 1,-1.475; 6 1,1.475; 7 0.5,1.475; 8 0,1.475; 9 -0.5,1.475; 10 -1,1.475 | smd 0.7 x 0.28: 11 -1.5,0.25; 12 -1.5,-0.25; 13 1.5,0.25; 14 1.5,-0.25 | smd 2.4 x 1.65: 15 0,0
BME280 = smd 0.7 x 0.35: 1 1.025,0.975; 2 1.025,0.325; 3 1.025,-0.325; 4 1.025,-0.975; 5 -1.025,-0.975; 6 -1.025,-0.325; 7 -1.025,0.325; 8 -1.025,0.975
UBLOX_MAX = smd 1.8 x 0.7: 1-GND 4.95,-4.4; 9-V_RESET 4.95,4.3; 10-GND -4.55,4.3; 18-RESERVED -4.55,-4.4 | smd 1.8 x 0.8: 2-TXD1 4.95,-3.35; 3-RXD1 4.95,-2.25; 4-TIMEPULSE 4.95,-1.15; 5-EXTINT0 4.95,-0.05; 6-V_BCKP 4.95,1.05; 7-VCC_IO 4.95,2.15; 8-VCC 4.95,3.25; 11-RFIN -4.55,3.25; 12-GND -4.55,2.15; 13-ANTON -4.55,1.05; 14-VCC_RF -4.55,-0.05; 15-RESERVED -4.55,-1.15; 16-SDA2 -4.55,-2.25; 17-SCL2 -4.55,-3.35

### Placement (x,y rotation side)
3V3_LED  73.51,56.55 90 top
3V3_LED_EN  73.47,38.67 90 top
ADC0  8.89,53.06 180 top
ADC1  8.89,57.01 180 top
BARO_ADDR_SEL  72.33,25.65 180 top
BCN_ADC0_SEL  33.27,38.73 0 top
BEACON  3.81,33.3 0 top
BT1  65.09,54.67 90 top
BUZZER  3.81,29.35 0 top
C1  76.01,15.3 0 top
C2  69.28,22.67 90 top
C3  31.43,7.05 90 top
C4  14.54,12.7 180 top
C5  21.91,4.38 180 top
C6  26.86,13.84 90 top
C7  62.48,69.72 0 top
C8  21.65,15.11 180 top
D3  77.91,64.01 90 top
GPS_ANT  70.87,79.12 0 top
GPS_LED  79.57,56.55 90 top
I2CA  13.97,41.2 180 top
I2CB  13.97,37.25 180 top
IRIDIUM  26.67,25.4 180 top
J1  4.45,16.51 90 top
J2  21.59,64.13 0 top
JP1  26.04,48.9 270 top
L1  62.48,74.8 180 top
L2  21.65,13.08 180 top
MS1  60.33,5.71 90 top
POWR_OUT  11.43,60.96 180 top
Q1  21.72,30.73 90 top
Q2  27.11,40.01 90 top
R1  32.45,23.56 90 top
R2  28.13,64.58 0 top
R3  62.48,72.14 0 top
R4  31.75,50.8 180 top
R5  31.75,47.63 180 top
R6  27.94,29.78 180 top
R7  16.13,9.46 90 top
R8  15.24,6.35 0 top
R9  79.57,43.28 90 top
R10  76.54,43.28 90 top
R11  73.51,43.28 90 top
R12  70.48,43.28 90 top
R13  65.28,62.61 0 top
R14  25.59,4.25 180 top
R15  26.67,9.53 90 top
R16  33.66,42.55 180 top
RADIO  47.62,67.31 0 top
RDIO_ANT  SMA_EDGE  [SMA-EDGE']  41.72,79.12 0 top
RX_LED  76.54,56.55 90 top
S1  28.57,79.18 0 top
SAT_EN  25.4,20.95 0 top
SATRDY_LED  70.48,56.55 90 top
SATRDY_LED_EN  70.48,38.67 90 top
SPIA  19.05,45.16 180 top
SPIA1  19.05,49.11 180 top
U1  21.59,9.53 180 top
U2  73.66,19.69 270 top
UBLOX  71.12,69.85 0 top
UBX_UART  80.96,73.53 270 top

### Tracks (layer width: path | path; a pad name or v marks a point on that pad's centre or on a via)
5V5
  Top 0.254: C8.1 22.55,14.91 23.5,13.97 23.5,12.07 22.22,12.07 22.09,11.93 U1.2
  Top 0.508: SPIA1.6 SPIA.6 I2CA.4 I2CB.4 | IRIDIUM.8 8.89,23.52 9.53,22.88 10.83,21.74 10.99,21.59 12.95,21.59 12.95,17.18 13.44,16.51 22.48,16.51 | 22.48,16.51 22.73,16.51 22.8,16.45 22.86,16.51 28.57,16.51 28.57,12.33 R15.2 | C8.1 22.55,16.44 22.48,16.51
  Bottom 0.508: I2CB.4 BEACON.2 BUZZER.2 8.89,26.42 IRIDIUM.8 | POWR_OUT.2 8.89,59.88 11.43,58.67 11.43,51.05 6.35,51.05 SPIA1.6
ADC1  (via drill 0.35)
  Top 0.508: MS1.6 57.79,24.77 45.28,38.04 v45.28,54.61 | ADC1.1 23.88,56.96 v26.88,57.79
  Bottom 0.508: v26.88,57.79 38.65,57.79 38.68,57.81 41.89,57.87 v45.28,54.61
BCN0  (via drill 0.35)
  Top 0.406: BCN_ADC0_SEL.2 v35.43,38.73
  Top 0.508: v26.88,56.71 24.26,56.01 13.84,56.01 10.86,53.09 ADC0.1 | MS1.5 57.79,22.23 43.62,37.02 43.62,39.37 | 43.62,39.37 v43.62,54.55 | 43.62,39.37 v42.8,39.37
  Bottom 0.406: v42.8,39.37 40.64,39.37 40.01,38.73 v35.43,38.73
  Bottom 0.508: v43.62,54.55 41.31,56.71 v26.88,56.71
BUZZ
  Top 0.508: MS1.25 38.67,29.78 R6.1
EDITINF
  Top 0.508: R16.2 32.7,43.18 BCN_ADC0_SEL.1 31.24,38.74 29.78,38.74 29.46,39.05 Q2.1
GND  (via drill 0.35, 0.4 pad 0.5)
  Top 0.254: U1.15 21.34,9.78 U1.14 18.43,11.43 v17.78,11.43
  Top 0.305: U1.4 21.09,10.03 U1.15 | U1.15 21.84,9.78 | U1.9 22.09,9.03 | 22.09,9.03 U1.15 | U1.11 22.34,9.28 22.09,9.03
  Top 0.508: v35.5,76.64 v38.1,76.64 41.72,76.64 RDIO_ANT.GND@2 | v57.79,76.84 v63.5,76.84 | v21.14,79.19 21.14,77.72 J2.GND3 | v12.26,15.49 8.8,15.49 J1.1 | v69.02,61.28 v69.02,49.28 | v71.88,61.28 v71.82,49.34 | v41.91,38.1 v41.91,41.27 | C8.2 20.5,15.37 v17.59,15.37 | v72.14,76.07 72.14,72.77 71.36,72 UBLOX.12-GND | v71.12,65.41 v71.12,69.22 | v57.79,78.1 v63.5,78.1
  Bottom 0.508: v18.16,76.45 18.16,79.19 v21.14,79.19 | v12.26,15.49 17.46,15.49 v17.59,15.37 | v41.91,24.57 v41.91,33.02 v41.91,38.1 | MS1.4 60.96,19.69 v60.96,13.27 | 71.12,61.28 v71.88,61.28 | v72.14,76.07 v68.33,76.07 GPS_ANT.GND@2 | GPS_ANT.GND@3 73.41,76.58 72.9,76.07 v72.14,76.07 | v21.97,53.4 v21.97,43.31 v29.53,43.31 | v50.55,59.94 54.04,56.58 v54.04,54.23 | v64.14,11.43 v66.36,11.43 v68.58,11.43 | v74.36,65.41 v71.12,65.41 71.12,61.28 | 71.12,61.28 v69.02,61.28 | v9.53,8.89 v12.7,8.89 | v29.53,15.37 v24.83,15.37 v17.59,15.37 | v17.78,11.43 17.59,11.62 v17.59,15.37 | v38.1,76.64 41.72,76.64 | 46.99,76.64 41.72,76.64 | 46.99,76.64 v52.32,76.64 | RDIO_ANT.GND@3 46.99,78.93 46.99,76.64 | RDIO_ANT.GND@2 41.72,76.64 | v72.14,76.07 72.14,72.77 71.12,71.75 v71.12,69.22
  pour Top: -5.71,87.63 36.64,87.63 36.64,57.66 93.34,57.66 93.34,-5.71 -5.08,-5.71
  pour Top: 37.47,87.63 59.69,87.63 59.69,58.42 37.47,58.42
  pour Top: 60.33,87.63 93.98,87.63 94.04,58.48 60.39,58.48
GPSLOCK_LED
  Top 0.508: R9.1 79.57,29.43 79.27,28.67 70.76,28.66 67.21,24.67 67.21,6.26 63.5,2.41 48.9,2.41 45.34,6.41 45.34,26.73 40.01,32.38 MS1.24
MISO  (via drill 0.35)
  Top 0.508: SPIA1.1 SPIA.1 | MS1.13 52.71,42.55 51.44,43.81 v51.44,53.98 | v43.88,72.26 39.67,72.26 RADIO.MISO 39.61,72.33 19.3,72.33 19.25,72.38 J2.DO 19.24,76.39 18.88,77.51 10.82,77.51 8.64,75.33 v8.64,67.69
  Bottom 0.508: v51.44,53.98 43.88,61.79 v43.88,72.26 | SPIA1.1 19.05,66.04 17.46,67.69 v8.64,67.69
MOSI  (via drill 0.35)
  Top 0.508: SPIA1.2 SPIA.2 | MS1.12 53.34,40.01 50.17,43.18 v50.17,53.98 | v42.86,70.29 39.64,70.29 RADIO.MOSI 14.94,70.31 14.85,70.4 J2.DI 14.86,76.07 12,76.07 11.43,75.5 v11.43,66.68
  Bottom 0.508: v50.17,53.98 42.86,61.4 v42.86,70.29 | SPIA1.2 17.78,50.8 17.78,65.41 16.51,66.68 v11.43,66.68
N$1
  Top 0.508: SAT_EN.2 30.48,20.95 32.13,22.61 R1.1
N$2
  Top 0.508: GPS_ANT.SIG 70.87,73.09 66.58,73.09 UBLOX.11-RFIN 65.04,73.1 L1.1
N$3
  Top 0.508: L1.2 R3.1 C7.1
N$4
  Top 0.508: UBLOX.14-VCC_RF 64.82,69.8 64.77,69.85 64.77,72.14 R3.2
N$5
  Top 0.508: RADIO.ANT 53.99,60.31 52.71,61.6 52.71,73.03 50.55,74.61 44.26,74.61 RDIO_ANT.SIG
N$6
  Top 0.508: R5.2 arc90 30.55,47.88 JP1.3
N$7
  Top 0.508: JP1.1 26.04,50.8 R4.2
N$8
  Top 0.508: Q1.1 R6.2
N$9
  Top 0.508: BUZZER.1 3.81,30.73 17.78,30.73 18.03,30.73 Q1.3
N$10
  Top 0.508: R9.2 GPS_LED.A
N$11
  Top 0.508: UBLOX.6-V_BCKP 76.04,70.87 70.04,70.87 70.04,64.52 69.66,64.13 64.33,64.13 R13.1 64.33,59.55 BT1.+
N$12
  Top 0.508: SATRDY_LED_EN.2 R12.1
N$13
  Top 0.508: RX_LED.A R10.2
N$14
  Top 0.508: R11.2 3V3_LED.A
N$15
  Top 0.508: R11.1 3V3_LED_EN.2
N$16
  Top 0.508: D3.C 67.75,62.86 67.5,62.61 R13.2
N$17
  Top 0.305: U2.5 72.69,22.56 72.33,22.92 BARO_ADDR_SEL.2
N$18
  Top 0.508: R12.2 SATRDY_LED.A
N$19
  Top 0.203: U1.7 21.06,8.02
  Top 0.254: 21.06,8.02 C5.2
  Top 0.305: C5.2 19.09,6.35 R8.2 R7.1
N$20
  Top 0.508: UBX_UART.2 81.85,70.99 82.58,70.26 | 82.58,70.26 82.58,70.04 | 76.03,67.56 UBLOX.3-RXD1 72.19,67.6 72.17,66.76 72.17,64.31 72.18,63.73 82.32,63.73 82.58,63.99 82.58,70.26
N$21
  Top 0.508: UBX_UART.3 80.96,64.39 73.02,64.39 73.02,66.49 74.06,66.5 UBLOX.2-TXD1
N$22
  Top 0.203: R15.1 26.09,8.05 24.77,8.05 24.77,4.33 R14.2
  Top 0.254: U1.10 24.77,8.05
N$23
  Top 0.254: L2.1 21.59,12.17 U1.3
N$24
  Top 0.254: U1.1 22.61,11.02 22.61,11.62 25.49,11.62 C6.1
N$25
  Top 0.508: BEACON.1 3.81,34.93 10.16,34.93 10.16,32.83 17.08,32.83 17.08,36.51 21.84,36.51 25.34,40.01 Q2.3
RADIO_IRQ  (via drill 0.35)
  Top 0.508: MS1.9 v65.41,32.38 | RADIO.DIO0 57.83,70.31 v57.85,70.29
  Bottom 0.508: v57.85,70.29 57.98,70.29 62.87,66.68 62.87,50.8 65.41,48.26 v65.41,32.38
RADIO_SS  (via drill 0.35)
  Top 0.508: RADIO.NSS 39.36,66.04 36.2,66.04 v36.2,51.56
  Bottom 0.381: 40.96,40.01 40.96,51.12 40.58,51.56 v36.2,51.56
  Bottom 0.508: 40.96,40.01 MS1.21
RADIORX_LED
  Top 0.508: MS1.20 40.93,42.55 40.93,37.13 47.03,31.04 47.03,6.95 49.55,3.79 62.71,3.79 65.41,6.35 65.41,24.77 69.85,29.21 69.85,32.38 71.75,34.29 74.29,34.29 76.53,36.33 R10.1
RX
  Bottom 0.508: MS1.14 57.78,45.09 56.04,43.33 56.16,21.97 53.62,19.18 30.99,19.18 26.67,23.49 IRIDIUM.1
SAT_EN
  Top 0.508: IRIDIUM.7 11.43,23.37 22.22,23.37 22.22,20.95 SAT_EN.1
  Bottom 0.508: MS1.16 61.3,50.16 62.87,48.6 62.87,7.62 60.33,4.83 56.52,4.83 55.25,6.35 55.25,15.88 54.29,16.83 11.43,16.83 IRIDIUM.7
SAT_NETAV
  Top 0.508: MS1.7 65.41,27.3 67.44,29.34 67.44,32.51 70.48,35.56 SATRDY_LED_EN.1
  Bottom 0.508: IRIDIUM.4 19.05,24.77 19.06,22.21 22.89,18.39 54.05,18.39 57.02,21.72 57.02,25.91 58.42,27.3 MS1.7
SAT_RI
  Bottom 0.508: IRIDIUM.5 16.51,21.59 20.5,17.6 54.79,17.6 56.52,15.88 56.52,10.67 62.21,10.8 62.21,28.6 60.96,29.84 MS1.8
SCK  (via drill 0.35)
  Top 0.508: v37.15,68.33 v37.97,68.33 39.61,68.33 RADIO.SCK 39.7,68.39 v41.85,68.39 | SPIA1.3 SPIA.3 | MS1.11 53.98,37.47 48.9,42.55 v48.9,53.98 | v9.91,65.72 9.91,75.23 11.41,76.8 17.04,76.8 J2.SCLK 17.08,74.8 v17.08,71.56
  Bottom 0.508: v17.08,71.56 36.13,71.56 36.13,68.33 v37.15,68.33 | v48.9,53.98 41.85,61.02 v41.85,68.39 | SPIA1.3 16.51,50.8 16.51,64.77 15.56,65.72 v9.91,65.72
SCL  (via drill 0.4 pad 0.5)
  Top 0.305: U2.4 72.69,17.42 72.71,17.4 72.07,16.76 v72.07,13.34
  Top 0.508: I2CA.2 I2CB.2 11.43,34.29 15.88,34.29 15.88,38.1 21.08,38.1 25.53,42.55 25.53,45.09 33.02,45.09 33.02,47.3 R5.1 MS1.18 41.28,47.63 42.67,49.02 42.67,57.15 43.24,57.72 61.15,57.72 62.74,61.47 62.74,66.5 UBLOX.17-SCL2 68.52,66.5 v68.52,66.42
  Bottom 0.508: v72.07,13.34 78.74,13.34 80.01,15.88 80.01,64.77 78.36,66.42 v68.52,66.42
SD_CD  (via drill 0.35)
  Top 0.508: v60.96,48.26 60.96,56.52 v50.8,56.52 | v42.55,75.56 31.75,75.56 30.92,74.74 30.92,73.22 v22.8,73.22 | R2.1 27.14,64.53 J2.CD1 16.75,64.53 13.97,67.31 12.45,67.31 v12.45,73.22
  Bottom 0.508: MS1.10 60.96,36.83 v60.96,48.26 | v50.8,56.52 45.09,62.23 45.09,73.03 44.45,73.66 42.55,73.66 v42.55,75.56 | v22.8,73.22 v12.45,73.22
SD_SS  (via drill 0.35)
  Top 0.508: v14.61,69.15 13.75,69.82 J2.CS
  Bottom 0.508: MS1.19 23.5,45.09 23.5,69.34 14.54,69.28 v14.61,69.15
SDA  (via drill 0.4 pad 0.5)
  Top 0.305: U2.3 73.34,18.65 73.34,12.19 v73.47,12.07
  Top 0.508: I2CB.1 I2CA.1 16.83,41.21 19.3,41.21 20,41.91 20.95,41.91 20.95,50.16 23.5,52.71 32.38,52.71 32.7,52.39 R4.1 34.93,50.8 34.93,50.16 37.47,50.16 | 37.47,50.16 MS1.17 | v68.52,67.63 68.52,67.6 UBLOX.16-SDA2 66.53,67.56 61.72,67.56 61.72,61.76 60.39,58.65 38.96,58.65 37.47,57.15 37.47,50.16
  Bottom 0.508: v68.52,67.63 79.06,67.63 81.28,65.41 81.28,15.56 79.38,12.07 v73.47,12.07
SPIA_SS
  Bottom 0.508: SPIA.4 11.43,42.99 16,42.99 16,36.07 17.08,34.99 38.67,34.99 MS1.23
SPIB_SS
  Bottom 0.508: SPIA1.4 11.43,46.99 20.95,46.99 20.95,38.73 22.22,37.47 MS1.22
TX
  Bottom 0.508: MS1.15 57.79,47.63 55.25,45.09 55.25,22.23 53.18,20.03 44.3,20.03 31.43,20 29.46,21.97 29.46,27.05 27.94,28.58 14.1,28.58 13.97,28.45 IRIDIUM.6
VBAT  (via drill 0.35)
  Top 0.203: U1.6 20.38,8.26 18.41,8.26 18.41,10.16 18.21,10.36 R7.2
  Top 0.254: C5.1 21.59,5.55 U1.8
  Top 0.305: 16.13,12.51 C4.1 | U1.5 20.59,12.7 20.59,12.87 L2.2
  Top 0.508: MS1.28 36.96,20.32 36.96,4.45 35.05,2.54 31.37,2.54 | S1.3 30.48,77.09 30.48,76.2 v29.21,76.2 v29.21,75.31 | 22.86,2.54 13.33,2.54 11.43,4.45 11.43,10.16 15.93,10.16 R7.2 16.13,12.51 | 22.86,2.54 22.86,4.28 C5.1 | 31.37,2.54 22.86,2.54 | C4.1 20.59,12.7 | C3.P$1 31.43,2.6 31.37,2.54
  Bottom 0.508: POWR_OUT.3 6.35,62.87 1.91,62.87 1.91,74.93 6.98,74.93 6.98,80.01 22.86,80.01 22.86,76.39 v24.26,76.39 24.26,74.23 29.21,74.21 | MS1.28 46.36,22.23 47.62,23.49 47.62,54.01 46.54,55.08 40.83,60.9 40.83,74.17 29.21,74.21 | 29.21,74.21 v29.21,76.2 | v29.21,76.2
VBAT_SUPPLY
  Top 0.508: S1.2 27.82,75.44 27.18,74.8 23.62,74.8 22.86,75.56 22.86,81.01 6.72,81.01 6.45,80.74 6.48,80.71 6.48,74.93 1.91,74.93 1.91,22.86 8.53,22.86 10.78,20.8 12.13,20.8 12.13,17.4 8.89,17.4 J1.2
VCC  (via drill 0.35, 0.4 pad 0.5)
  Top 0.305: C1.1 73.98,16.48 U2.2 73.98,19.69 | U2.8 74.63,19.9 74.43,19.69 73.98,19.69 | U2.6 73.33,20.32 | 73.33,20.32 73.33,19.69 | 73.33,19.69 69.52,19.69 69.27,19.95 69.28,20.26 C2.1 | 73.33,19.69 73.98,19.69 | 73.33,20.32 73.34,20.33 BARO_ADDR_SEL.1 73.34,26.35 74.17,27.18 v74.87,27.18 v75.82,27.18
  Top 0.508: RADIO.VCC v57.34,68.26 v58.17,68.26 | v16,71.56 16,74.98 J2.VCC | MS1.2 62.87,14.61 63.31,15.68 63.31,23.81 68.58,29.21 68.58,32.38 71.75,35.56 73.47,35.56 v73.47,35.62 3V3_LED_EN.1 | JP1.2 v27.69,48.9 | v78.99,73.34 v78.99,74.17 77.91,74.17 | SPIA1.5 8.89,51.05 10.16,51.05 14.27,54.91 24.93,54.91 27.04,55.75 v27.69,55.75 27.69,60.26 29.08,61.66 R2.2 | ADC1.2 6.35,58.42 11.43,58.42 POWR_OUT.1 | 77.91,74.17 76.09,74.17 UBLOX.9-V_RESET | UBLOX.8-VCC 77.91,73.09 | 77.91,73.09 77.91,72.01 | 77.91,72.01 D3.A | UBLOX.7-VCC_IO 77.91,72.01 | 77.91,73.09 77.91,74.17 | R1.2 v32.45,27.3
  Bottom 0.508: v27.69,55.75 v27.69,48.9 | v32.45,27.3 v32.45,31.75
  pour Bottom: -5.71,88.27 93.98,88.27 93.34,-6.35 -5.08,-5.71

### Text on the board
tNames: < OFF - ON > | GND | VBAT | 5V5 | VCC | Designed in Monterrey Mexico | ASFM | in Humberto Lobo Morales STEM LAB | SAT | 3V | RAD | GPS | VCC | SKYLAB V1 Rev 3 - GEN 2 (HLM2) | AGO/31/2018 | 5V5 | VCC | SS | SCK | MOS | MIS | SCL | SDA | + | RX | 5V5 | EN | TX | RI | AV | 3.7VDC MAX | LI/ION 1S
bNames: HLM STEM LAB @ ASFM